# Altium schematic sheet Sheet1.SchDoc
size A1
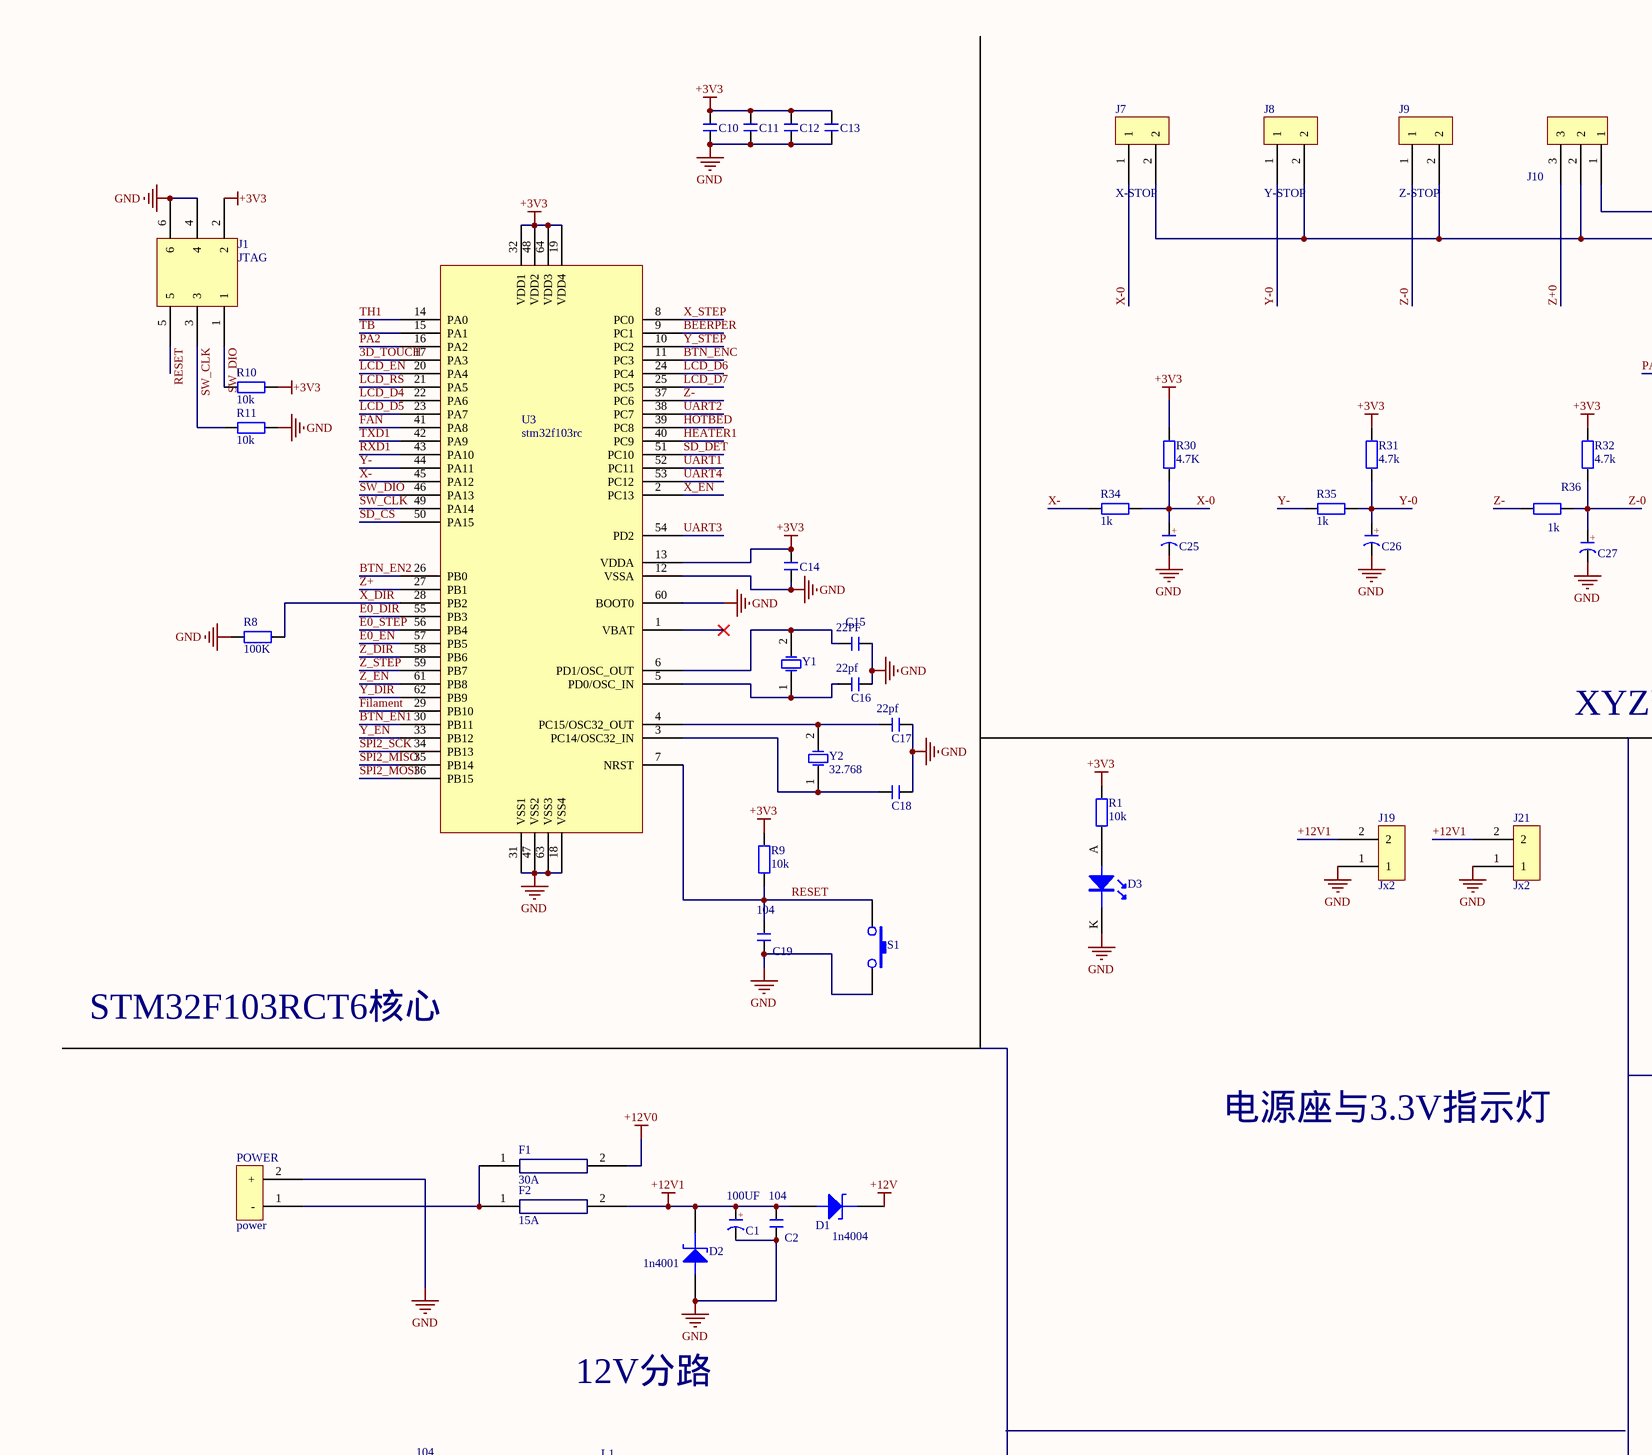
[diagram p0: Sheet1.SchDoc, top left]
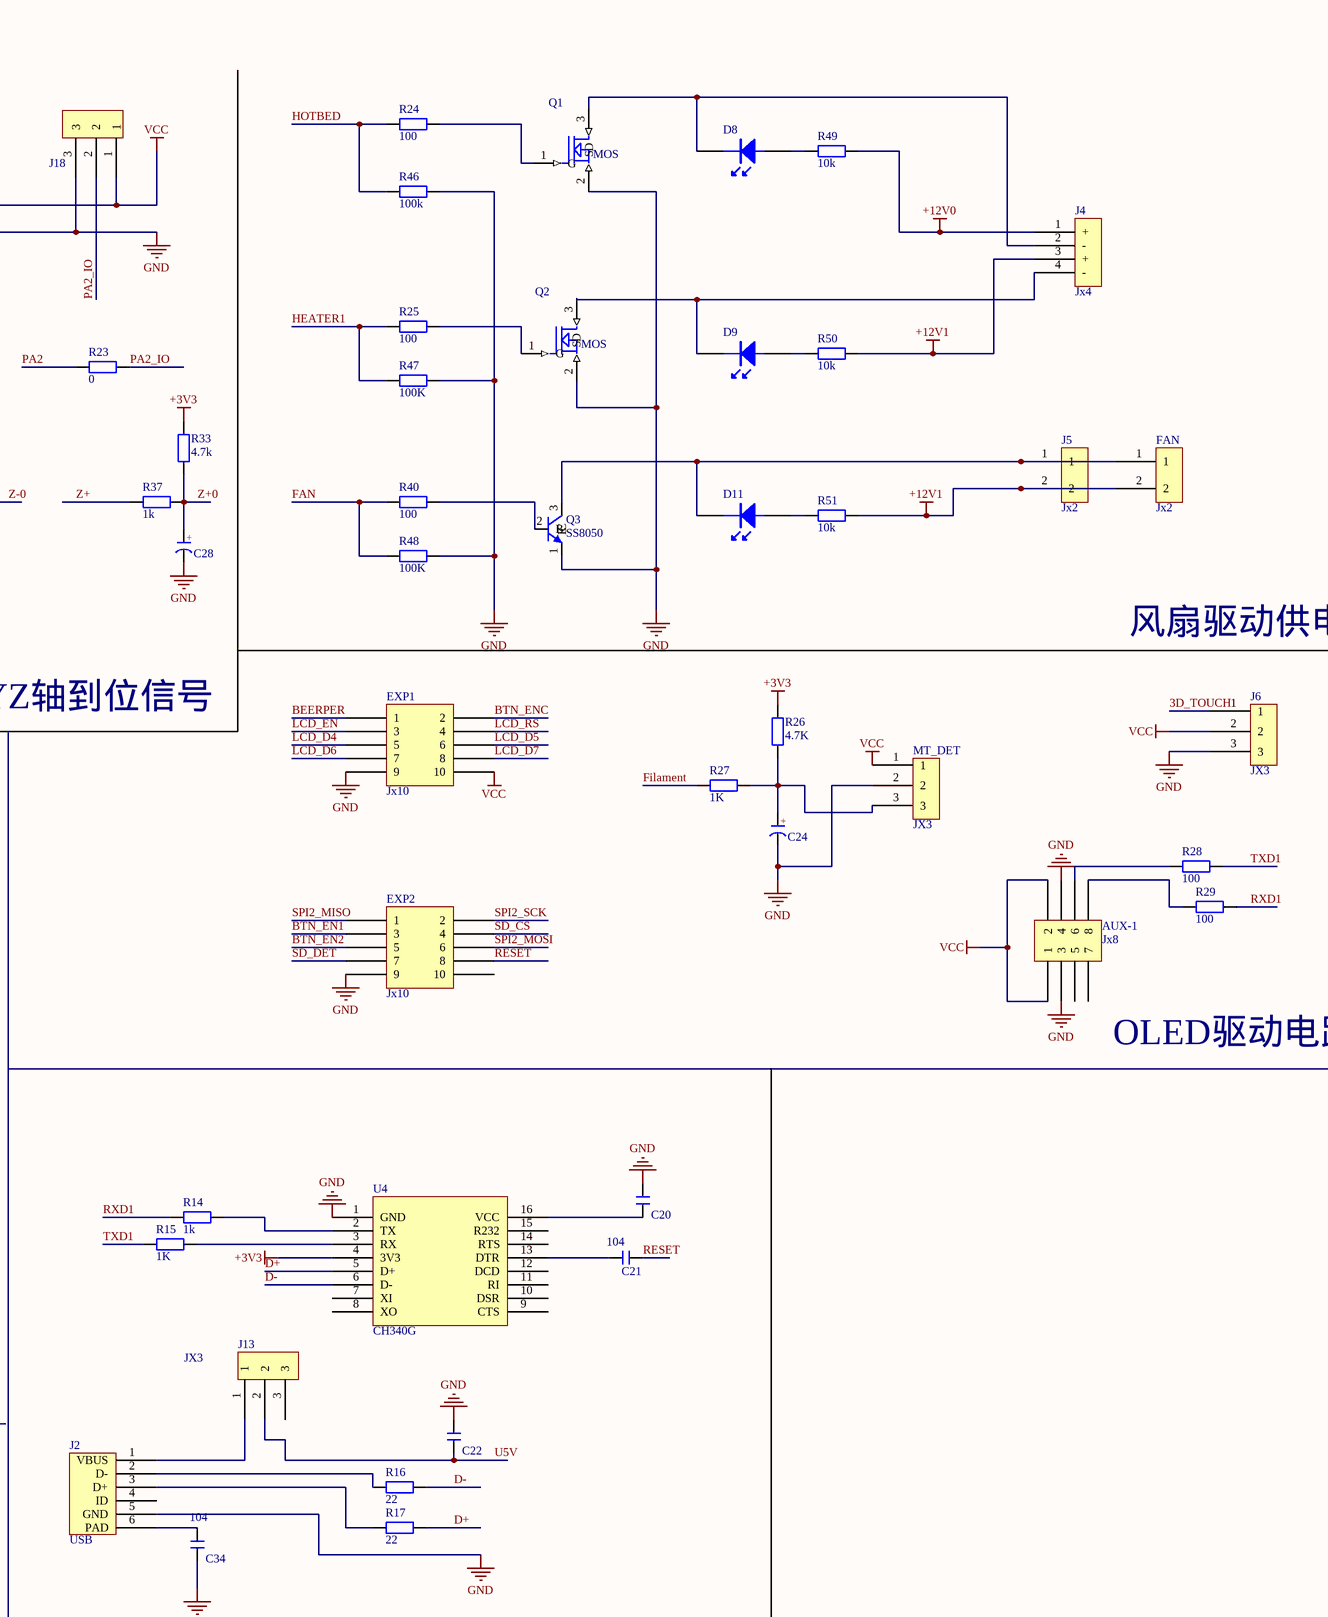
[diagram p1: Sheet1.SchDoc, top middle]
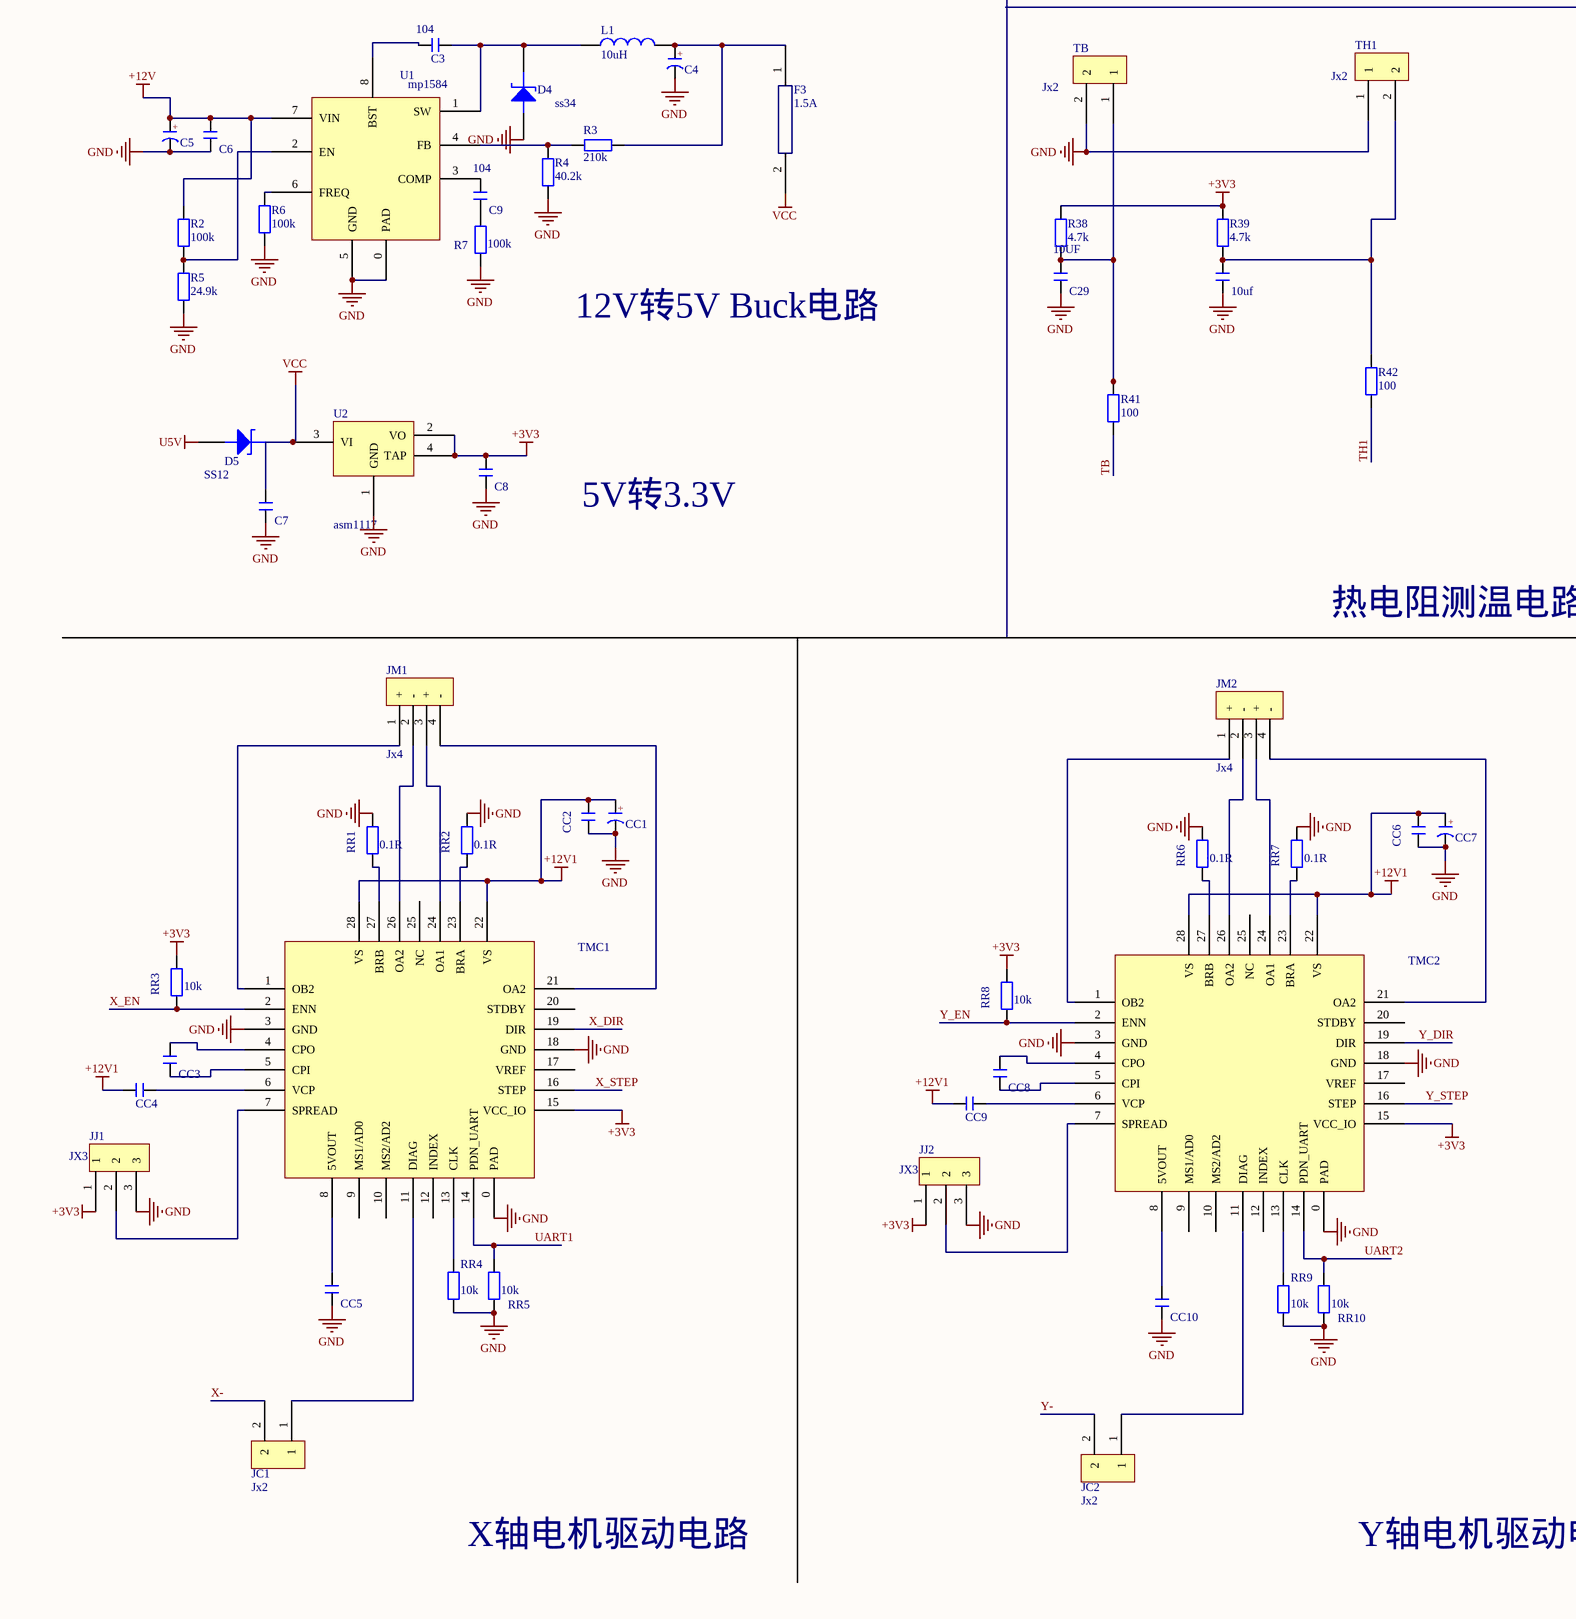
[diagram p2: Sheet1.SchDoc, bottom left]
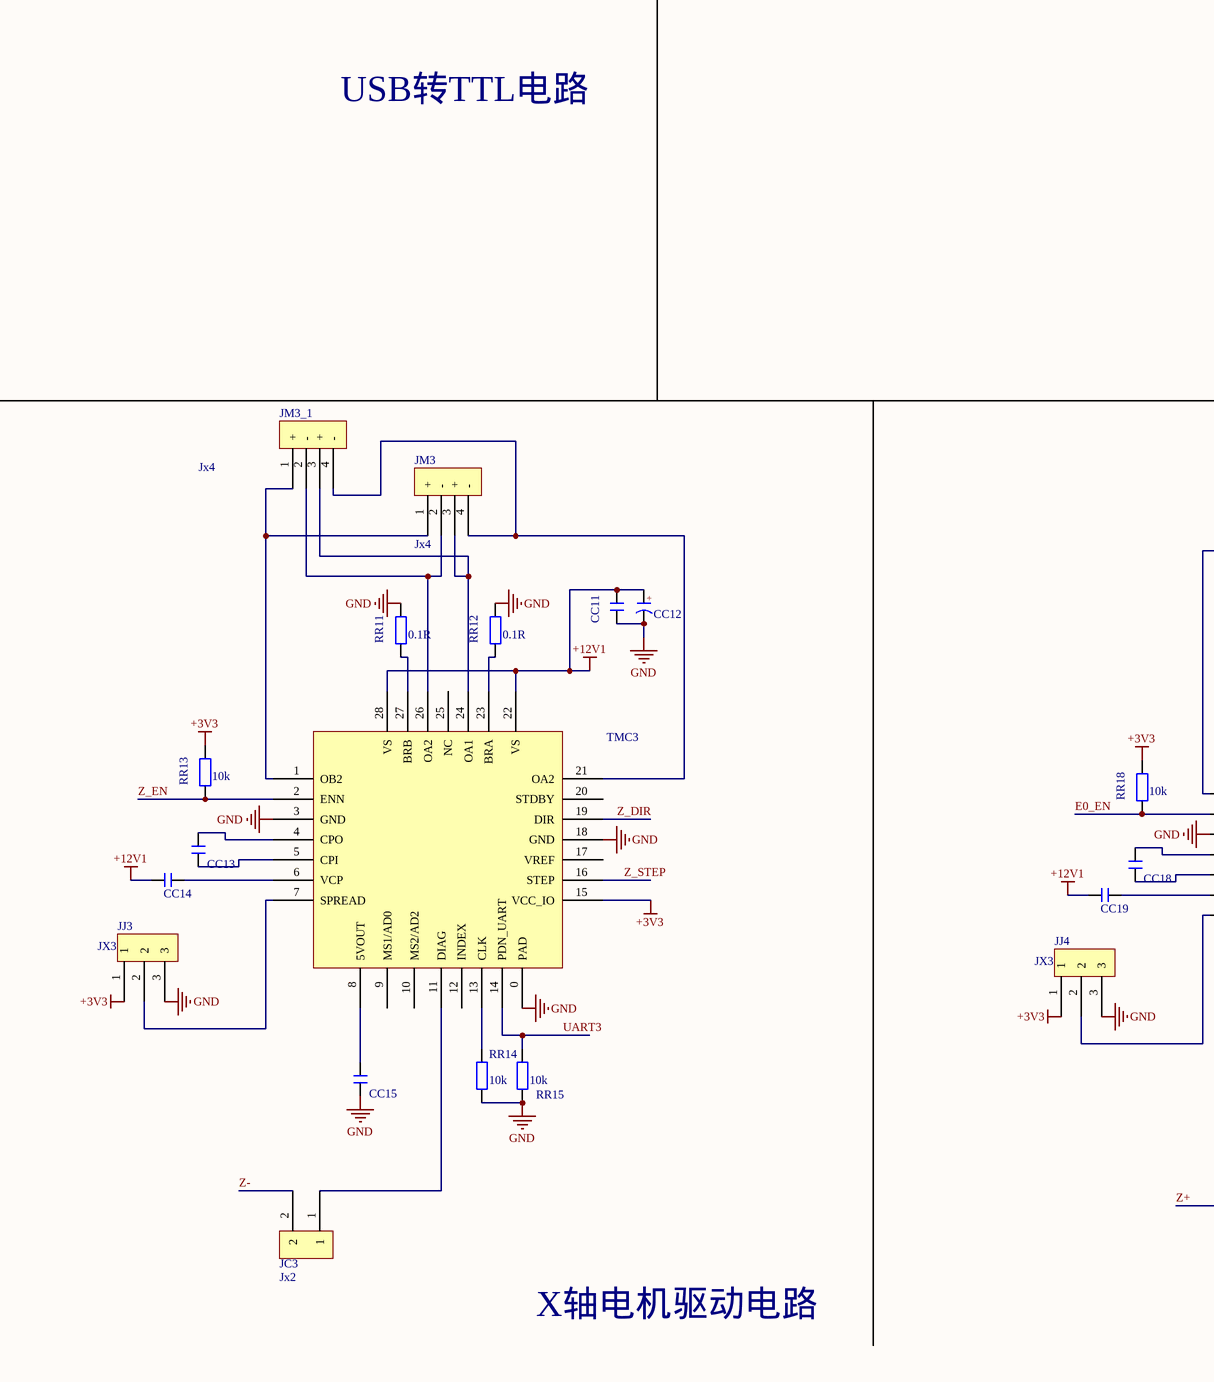
[diagram p3: Sheet1.SchDoc, bottom middle]
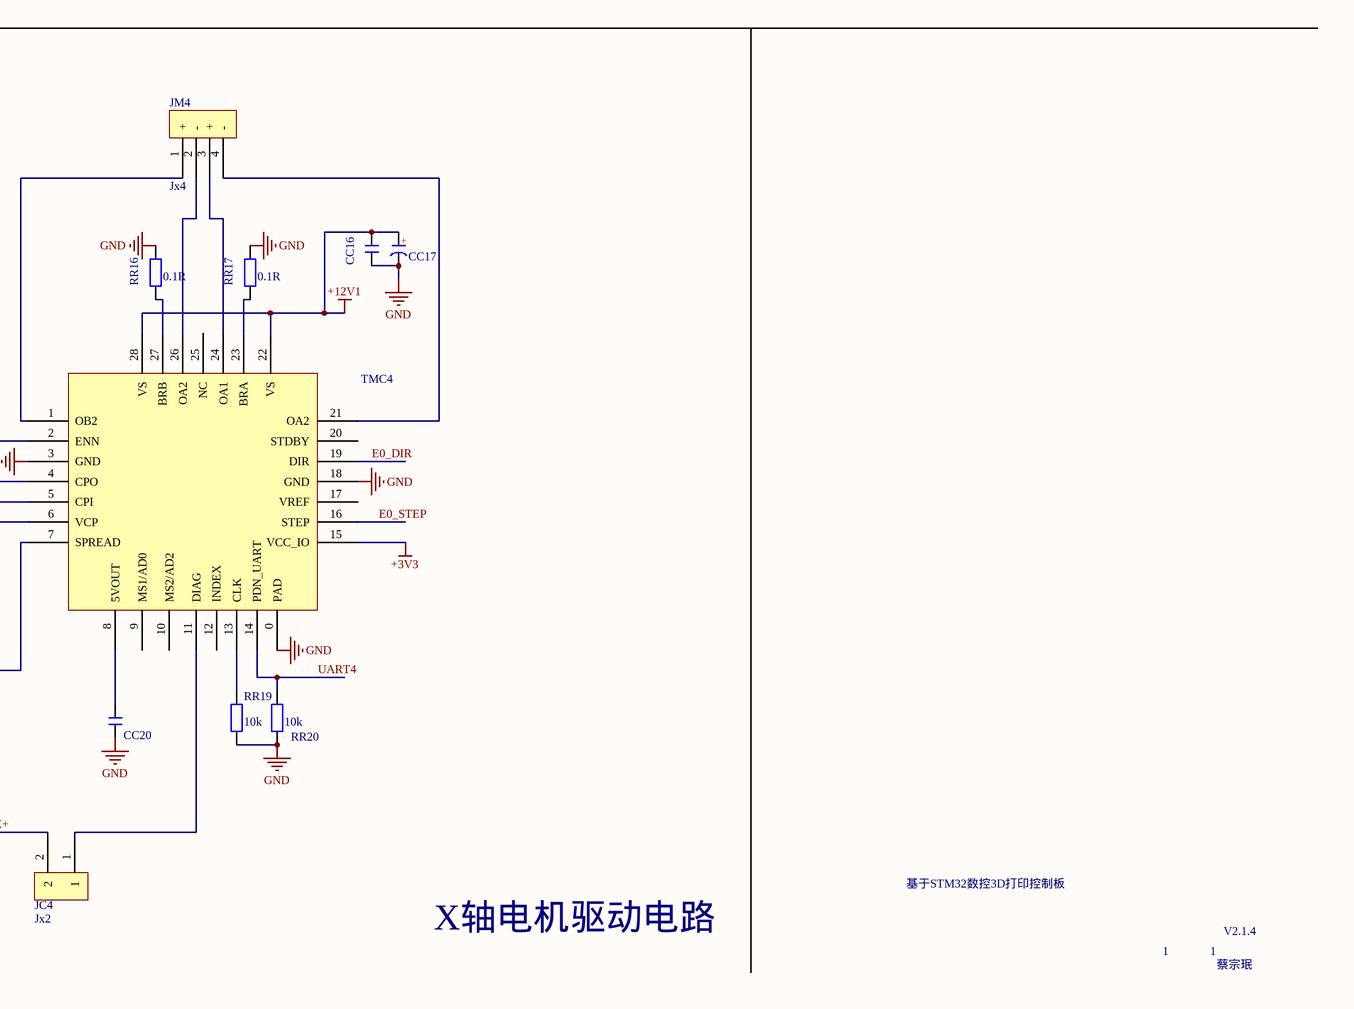
[diagram p4: Sheet1.SchDoc, bottom right]

## Parts
10uf  104  [C 0603_M]  (value not drawn)
AUX-1  Jx8  [IDC_8P]
C1  100UF  [CS 3.5*8*8 - C]
C2  104  [C 0603_M]
C3  104  [C 0603_M]
C4  220uf  [CS 3.5*8*8 - C]  (value not drawn)
C5  10uF/10V  [CS 3.5*8*8 - C]  (value not drawn)
C6  104  [C 0603_M]  (value not drawn)
C7  10uf  [C 0603_M]  (value not drawn)
C8  10uf  [C 0603_M]  (value not drawn)
C9  104  [C 0603_M]
C10  104  [C 0603_M]  (value not drawn)
C11  104  [C 0603_M]  (value not drawn)
C12  104  [C 0603_M]  (value not drawn)
C13  104  [C 0603_M]  (value not drawn)
C14  104  [C 0603_M]  (value not drawn)
C15  22PF  [C 0603_M]
C16  22pf  [C 0603_M]
C17  22pf  [C 0603_M]
C18  22pf  [C 0603_M]  (value not drawn)
C19  104  [C 0603_M]
C20  104  [C 0603_M]  (value not drawn)
C21  104  [C 0603_M]
C22  104  [C 0603_M]  (value not drawn)
C24  10uF/10V  [C 0603_M]  (value not drawn)
C25  10uF/10V  [C 0603_M]  (value not drawn)
C26  10uF/10V  [C 0603_M]  (value not drawn)
C27  10uF/10V  [C 0603_M]  (value not drawn)
C28  10uF/10V  [C 0603_M]  (value not drawn)
C29  10UF  [C 0603_M]
C34  104  [C 0603_M]
CC1  10uF/10V  [C 1206_M]  (value not drawn)
CC2  104  [C 0603_M]  (value not drawn)
CC3  104  [C 0603_M]  (value not drawn)
CC4  104  [C 0603_M]  (value not drawn)
CC5  104  [C 0603_M]  (value not drawn)
CC6  104  [C 0603_M]  (value not drawn)
CC7  10uF/10V  [C 1206_M]  (value not drawn)
CC8  104  [C 0603_M]  (value not drawn)
CC9  104  [C 0603_M]  (value not drawn)
CC10  104  [C 0603_M]  (value not drawn)
CC11  104  [C 0603_M]  (value not drawn)
CC12  10uF/10V  [C 1206_M]  (value not drawn)
CC13  104  [C 0603_M]  (value not drawn)
CC14  104  [C 0603_M]  (value not drawn)
CC15  104  [C 0603_M]  (value not drawn)
CC16  104  [C 0603_M]  (value not drawn)
CC17  10uF/10V  [C 1206_M]  (value not drawn)
CC18  104  [C 0603_M]  (value not drawn)
CC19  104  [C 0603_M]  (value not drawn)
CC20  104  [C 0603_M]  (value not drawn)
D1  1n4004  [SMA]
D2  1n4001  [SMA]
D3  发光二极管  [myLed0805]  (value not drawn)
D4  ss34  [SMA]
D5  SS12  [SMA]
D8  发光二极管  [myLed0805]  (value not drawn)
D9  发光二极管  [myLed0805]  (value not drawn)
D11  发光二极管  [myLed0805]  (value not drawn)
EXP1  Jx10  [DC3-10P]
EXP2  Jx10  [DC3-10P]
F1  30A  [FU 1206]
F2  15A  [FU 1206]
F3  1.5A  [FU 1206]
FAN  Jx2  [my_XH2.54-2]
J1  JTAG  [HDR2.54-LI-2x3P]
J2  USB  [myMicrousb]
J4  Jx4  [HX5.08-4L]
J5  Jx2  [my_XH2.54-2]
J6  JX3  [HDR2.54-LI-3P]
J7  X-STOP  [my_XH2.54-2]
J8  Y-STOP  [my_XH2.54-2]
J9  Z-STOP  [my_XH2.54-2]
J10  JX3  [XH_3p]  (value not drawn)
J13  JX3  [HDR2.54-LI-3P]
J18  JX3  [XH_3p]  (value not drawn)
J19  Jx2  [my_XH2.54-2]
J21  Jx2  [my_XH2.54-2]
JC1  Jx2  [HDR2.54-LI-2P]
JC2  Jx2  [HDR2.54-LI-2P]
JC3  Jx2  [HDR2.54-LI-2P]
JC4  Jx2  [HDR2.54-LI-2P]
JJ1  JX3  [HDR2.54-LI-3P]
JJ2  JX3  [HDR2.54-LI-3P]
JJ3  JX3  [HDR2.54-LI-3P]
JJ4  JX3  [HDR2.54-LI-3P]
JM1  Jx4  [XH2.54-4]
JM2  Jx4  [XH2.54-4]
JM3  Jx4  [XH2.54-4]
JM3_1  Jx4  [XH2.54-4]
JM4  Jx4  [XH2.54-4]
L1  10uH  [CDRH74]
MT_DET  JX3  [XH_3p]
POWER  power  [HX5.08-2L]
Q1  MOS  [TO252]
Q2  MOS  [TO252]
Q3  SS8050  [SOT23]
R1  10k  [R 0603_M]
R2  100k  [R 0603_M]
R3  210k  [R 0603_M]
R4  40.2k  [R 0603_M]
R5  24.9k  [R 0603_M]
R6  100k  [R 0603_M]
R7  100k  [R 0603_M]
R8  100K  [R 0603_M]
R9  10k  [R 0603_M]
R10  10k  [R 0603_M]
R11  10k  [R 0603_M]
R14  1k  [R 0603_M]
R15  1K  [R 0603_M]
R16  22  [R 0603_M]
R17  22  [R 0603_M]
R23  0  [R 0603_M]
R24  100  [R 0603_M]
R25  100  [R 0603_M]
R26  4.7K  [R 0603_M]
R27  1K  [R 0603_M]
R28  100  [R 0603_M]
R29  100  [R 0603_M]
R30  4.7K  [R 0603_M]
R31  4.7k  [R 0603_M]
R32  4.7k  [R 0603_M]
R33  4.7k  [R 0603_M]
R34  1k  [R 0603_M]
R35  1k  [R 0603_M]
R36  1k  [R 0603_M]
R37  1k  [R 0603_M]
R38  4.7k  [R 0603_M]
R39  4.7k  [R 0603_M]
R40  100  [R 0603_M]
R41  100  [R 0603_M]
R42  100  [R 0603_M]
R46  100k  [R 0603_M]
R47  100K  [R 0603_M]
R48  100K  [R 0603_M]
R49  10k  [R 0603_M]
R50  10k  [R 0603_M]
R51  10k  [R 0603_M]
RR1  0.1R  [R 1206_L]
RR2  0.1R  [R 1206_L]
RR3  10k  [R 0603_M]
RR4  10k  [R 0603_M]
RR5  10k  [R 0603_M]
RR6  0.1R  [R 1206_L]
RR7  0.1R  [R 1206_L]
RR8  10k  [R 0603_M]
RR9  10k  [R 0603_M]
RR10  10k  [R 0603_M]
RR11  0.1R  [R 1206_L]
RR12  0.1R  [R 1206_L]
RR13  10k  [R 0603_M]
RR14  10k  [R 0603_M]
RR15  10k  [R 0603_M]
RR16  0.1R  [R 1206_L]
RR17  0.1R  [R 1206_L]
RR18  10k  [R 0603_M]
RR19  10k  [R 0603_M]
RR20  10k  [R 0603_M]
S1  微动开关  [TSW SMD-3*6*2.5]  (value not drawn)
TB  Jx2  [my_XH2.54-2]
TH1  Jx2  [my_XH2.54-2]
TMC1  TMC2208  [my_2208]  (value not drawn)
TMC2  TMC2208  [my_2208]  (value not drawn)
TMC3  TMC2208  [my_2208]  (value not drawn)
TMC4  TMC2208  [my_2208]  (value not drawn)
U1  mp1584  [MP1584EN]
U2  asm1117  [SOT-223]
U3  stm32f103rc  [LQFP64_M]
U4  CH340G  [SOP16]
Y1  8MHz  [OSC HC-49S]  (value not drawn)
Y2  32.768  [OSC-3x8-LI]

## Nets
+3V3: C8.1 C10.2 C11.2 C12.2 C13.2 C14.2 J1.2 JJ1.1 JJ2.1 JJ3.1 JJ4.1 R1.2 R9.2 R10.1 R26.1 R30.2 R31.2 R32.2 R33.2 R38.1 R39.1 RR3.2 RR8.2 RR13.2 RR18.2 TMC1.15(VCC_IO) TMC2.15(VCC_IO) TMC3.15(VCC_IO) TMC4.15(VCC_IO) U2.2(VO) U2.4(TAP) U3.13(VDDA) U3.19(VDD4) U3.32(VDD1) U3.48(VDD2) U3.64(VDD3) U4.4(3V3)
+12V: C5.1(A) C6.1 D1.2(K) R2.2 U1.7(VIN)
+12V0: F1.2(+) J4.1(+) R49.1
+12V1: C1.1(A) C2.1 CC1.1(A) CC2.1 CC4.2 CC6.1 CC7.1(A) CC9.2 CC11.1 CC12.1(A) CC14.2 CC16.1 CC17.1(A) CC19.2 D1.1(A) D2.2(K) F2.2(+) FAN.2 J4.3(+) J5.2 J19.2 J21.2 R50.1 R51.1 TMC1.22(VS) TMC1.28(VS) TMC2.22(VS) TMC2.28(VS) TMC3.22(VS) TMC3.28(VS) TMC4.22(VS) TMC4.28(VS)
GND: 10uf.2 AUX-1.3 AUX-1.4 C1.2(K) C2.2 C4.2(K) C5.2(K) C6.2 C7.2 C8.2 C10.1 C11.1 C12.1 C13.1 C14.1 C15.1 C16.1 C17.1 C18.1 C19.2 C20.1 C22.2 C24.2(K) C25.2(K) C26.2(K) C27.2(K) C28.2(K) C29.2 C34.1 CC1.2(K) CC2.2 CC5.2 CC6.2 CC7.2(K) CC10.2 CC11.2 CC12.2(K) CC15.2 CC16.2 CC17.2(K) CC20.2 D2.1(A) D3.K D4.1(A) EXP1.9 EXP2.9 J1.4 J1.6 J2.5(GND) J6.3 J7.2 J8.2 J9.2 J10.2 J18.3 J19.1 J21.1 JJ1.3 JJ2.3 JJ3.3 JJ4.3 MT_DET.2 POWER.2(+) Q1.2(S) Q2.2(S) Q3.1(E) R4.1 R5.1 R6.1 R7.1 R8.2 R11.1 R46.1 R47.1 R48.1 RR1.2 RR2.2 RR4.1 RR5.1 RR6.2 RR7.2 RR9.1 RR10.1 RR11.2 RR12.2 RR14.1 RR15.1 RR16.2 RR17.2 RR19.1 RR20.1 S1.2 TB.2 TH1.1 TMC1.0(PAD) TMC1.3(GND) TMC1.18(GND) TMC2.0(PAD) TMC2.3(GND) TMC2.18(GND) TMC3.0(PAD) TMC3.3(GND) TMC3.18(GND) TMC4.0(PAD) TMC4.3(GND) TMC4.18(GND) U1.0(PAD) U1.5(GND) U2.1(GND) U3.12(VSSA) U3.18(VSS4) U3.31(VSS1) U3.47(VSS2) U3.60(BOOT0) U3.63(VSS3) U4.1(GND)
U5V: C22.1 D5.1(A) J13.2
VCC: AUX-1.1 AUX-1.2 C7.1 D5.2(K) EXP1.10 F3.2(+) J6.2 J10.1 J18.1 MT_DET.1 U2.3(VI)
3D_TOUCH: J6.1 U3.17(PA3)
BEERPER: EXP1.1 U3.9(PC1)
BTN_EN1: EXP2.3 U3.30(PB11)
BTN_EN2: EXP2.5 U3.26(PB0)
BTN_ENC: EXP1.2 U3.11(PC3)
D+: R17.1 U4.5(D+)
D-: R16.1 U4.6(D-)
E0_DIR: TMC4.19(DIR) U3.55(PB3)
E0_EN: RR18.1 TMC4.2(ENN) U3.57(PB5)
E0_STEP: TMC4.16(STEP) U3.56(PB4)
FAN: R40.2 R48.2 U3.41(PA8)
Filament: R27.2 U3.29(PB10)
HEATER1: R25.2 R47.2 U3.40(PC9)
HOTBED: R24.2 R46.2 U3.39(PC8)
LCD_D4: EXP1.5 U3.22(PA6)
LCD_D5: EXP1.6 U3.23(PA7)
LCD_D6: EXP1.7 U3.24(PC4)
LCD_D7: EXP1.8 U3.25(PC5)
LCD_EN: EXP1.3 U3.20(PA4)
LCD_RS: EXP1.4 U3.21(PA5)
PA2: R23.2 U3.16(PA2)
PA2_IO: J18.2 R23.1
RESET: C19.1 C21.2 EXP2.8 J1.5 R9.1 S1.1 U3.7(NRST)
RXD1: R14.2 R29.1 U3.43(PA10)
SD_CS: EXP2.4 U3.50(PA15)
SD_DET: EXP2.7 U3.51(PC10)
SPI2_MISO: EXP2.1 U3.35(PB14)
SPI2_MOSI: EXP2.6 U3.36(PB15)
SPI2_SCK: EXP2.2 U3.34(PB13)
SW_CLK: J1.3 R11.2 U3.49(PA14)
SW_DIO: J1.1 R10.2 U3.46(PA13)
TB: R41.2 U3.15(PA1)
TH1: R42.2 U3.14(PA0)
TXD1: R15.2 R28.1 U3.42(PA9)
UART1: RR5.2 TMC1.14(PDN_UART) U3.52(PC11)
UART2: RR10.2 TMC2.14(PDN_UART) U3.38(PC7)
UART3: RR15.2 TMC3.14(PDN_UART) U3.54(PD2)
UART4: RR20.2 TMC4.14(PDN_UART) U3.53(PC12)
X-: JC1.2 R34.2 U3.45(PA12)
X-0: C25.1(A) J7.1 R30.1 R34.1
X_DIR: R8.1 TMC1.19(DIR) U3.28(PB2)
X_EN: RR3.1 TMC1.2(ENN) U3.2(PC13)
X_STEP: TMC1.16(STEP) U3.8(PC0)
Y-: JC2.2 R35.2 U3.44(PA11)
Y-0: C26.1(A) J8.1 R31.1 R35.1
Y_DIR: TMC2.19(DIR) U3.62(PB9)
Y_EN: RR8.1 TMC2.2(ENN) U3.33(PB12)
Y_STEP: TMC2.16(STEP) U3.10(PC2)
Z+: JC4.2 R37.2 U3.27(PB1)
Z+0: C28.1(A) J10.3 R33.1 R37.1
Z-: JC3.2 R36.2 U3.37(PC6)
Z-0: C27.1(A) J9.1 R32.1 R36.1
Z_DIR: TMC3.19(DIR) U3.58(PB6)
Z_EN: RR13.1 TMC3.2(ENN) U3.61(PB8)
Z_STEP: TMC3.16(STEP) U3.59(PB7)
Net10uf_1: 10uf.1 R39.2 R42.1 TH1.2
NetAUX-1_6: AUX-1.6 R28.2
NetAUX-1_8: AUX-1.8 R29.2
NetC3_1: C3.1 U1.8(BST)
NetC3_2: C3.2 D4.2(K) L1.1 U1.1(SW)
NetC4_1: C4.1(A) F3.1(+) L1.2 R3.1
NetC9_1: C9.1 U1.3(COMP)
NetC9_2: C9.2 R7.2
NetC15_2: C15.2 U3.6(PD1/OSC_OUT) Y1.2(OSC2)
NetC16_2: C16.2 U3.5(PD0/OSC_IN) Y1.1(OSC1)
NetC17_2: C17.2 U3.4(PC15/OSC32_OUT) Y2.2(OSC2)
NetC18_2: C18.2 U3.3(PC14/OSC32_IN) Y2.1(OSC1)
NetC20_2: C20.2 U4.16(VCC)
NetC21_1: C21.1 U4.13(DTR)
NetC24_1: C24.1(A) MT_DET.3 R26.2 R27.1
NetC29_1: C29.1 R38.2 R41.1 TB.1
NetC34_2: C34.2 J2.6(PAD)
NetCC3_1: CC3.1 TMC1.5(CPI)
NetCC3_2: CC3.2 TMC1.4(CPO)
NetCC4_1: CC4.1 TMC1.6(VCP)
NetCC5_1: CC5.1 TMC1.8(5VOUT)
NetCC8_1: CC8.1 TMC2.5(CPI)
NetCC8_2: CC8.2 TMC2.4(CPO)
NetCC9_1: CC9.1 TMC2.6(VCP)
NetCC10_1: CC10.1 TMC2.8(5VOUT)
NetCC13_1: CC13.1 TMC3.5(CPI)
NetCC13_2: CC13.2 TMC3.4(CPO)
NetCC14_1: CC14.1 TMC3.6(VCP)
NetCC15_1: CC15.1 TMC3.8(5VOUT)
NetCC18_1: CC18.1 TMC4.5(CPI)
NetCC18_2: CC18.2 TMC4.4(CPO)
NetCC19_1: CC19.1 TMC4.6(VCP)
NetCC20_1: CC20.1 TMC4.8(5VOUT)
NetD3_A: D3.A R1.1
NetD8_A: D8.A R49.2
NetD8_K: D8.K J4.2(-) Q1.3(D)
NetD9_A: D9.A R50.2
NetD9_K: D9.K J4.4(-) Q2.3(D)
NetD11_A: D11.A R51.2
NetD11_K: D11.K FAN.1 J5.1 Q3.3(C)
NetF1_1: F1.1(+) F2.1(+) POWER.1(-)
NetJ2_1: J2.1(VBUS) J13.1
NetJ2_2: J2.2(D-) R16.2
NetJ2_3: J2.3(D+) R17.2
NetJC1_1: JC1.1 TMC1.11(DIAG)
NetJC2_1: JC2.1 TMC2.11(DIAG)
NetJC3_1: JC3.1 TMC3.11(DIAG)
NetJC4_1: JC4.1 TMC4.11(DIAG)
NetJJ1_2: JJ1.2 TMC1.7(SPREAD)
NetJJ2_2: JJ2.2 TMC2.7(SPREAD)
NetJJ3_2: JJ3.2 TMC3.7(SPREAD)
NetJJ4_2: JJ4.2 TMC4.7(SPREAD)
NetJM1_1: JM1.1(+) TMC1.1(OB2)
NetJM1_2: JM1.2(-) TMC1.26(OA2)
NetJM1_3: JM1.3(+) TMC1.24(OA1)
NetJM1_4: JM1.4(-) TMC1.21(OA2)
NetJM2_1: JM2.1(+) TMC2.1(OB2)
NetJM2_2: JM2.2(-) TMC2.26(OA2)
NetJM2_3: JM2.3(+) TMC2.24(OA1)
NetJM2_4: JM2.4(-) TMC2.21(OA2)
NetJM3_1: JM3.1(+) JM3_1.1(+) TMC3.1(OB2)
NetJM3_2: JM3.2(-) JM3_1.2(-) TMC3.26(OA2)
NetJM3_3: JM3.3(+) JM3_1.3(+) TMC3.24(OA1)
NetJM3_4: JM3.4(-) JM3_1.4(-) TMC3.21(OA2)
NetJM4_1: JM4.1(+) TMC4.1(OB2)
NetJM4_2: JM4.2(-) TMC4.26(OA2)
NetJM4_3: JM4.3(+) TMC4.24(OA1)
NetJM4_4: JM4.4(-) TMC4.21(OA2)
NetQ1_1: Q1.1(G) R24.1
NetQ2_1: Q2.1(G) R25.1
NetQ3_2: Q3.2(B) R40.1
NetR2_1: R2.1 R5.2 U1.2(EN)
NetR3_2: R3.2 R4.2 U1.4(FB)
NetR6_2: R6.2 U1.6(FREQ)
NetR14_1: R14.1 U4.2(TX)
NetR15_1: R15.1 U4.3(RX)
NetRR1_1: RR1.1 TMC1.27(BRB)
NetRR2_1: RR2.1 TMC1.23(BRA)
NetRR4_2: RR4.2 TMC1.13(CLK)
NetRR6_1: RR6.1 TMC2.27(BRB)
NetRR7_1: RR7.1 TMC2.23(BRA)
NetRR9_2: RR9.2 TMC2.13(CLK)
NetRR11_1: RR11.1 TMC3.27(BRB)
NetRR12_1: RR12.1 TMC3.23(BRA)
NetRR14_2: RR14.2 TMC3.13(CLK)
NetRR16_1: RR16.1 TMC4.27(BRB)
NetRR17_1: RR17.1 TMC4.23(BRA)
NetRR19_2: RR19.2 TMC4.13(CLK)

Not connected (* = marked no-connect by the designer): AUX-1 5 7; EXP2 10; J2 4(ID); J13 3; TMC1 9(MS1/AD0) 10(MS2/AD2) 12(INDEX) 17(VREF) 20(STDBY) 25(NC); TMC2 9(MS1/AD0) 10(MS2/AD2) 12(INDEX) 17(VREF) 20(STDBY) 25(NC); TMC3 9(MS1/AD0) 10(MS2/AD2) 12(INDEX) 17(VREF) 20(STDBY) 25(NC); TMC4 9(MS1/AD0) 10(MS2/AD2) 12(INDEX) 17(VREF) 20(STDBY) 25(NC); U3 1(VBAT)*; U4 7(XI) 8(XO) 9(CTS) 10(DSR) 11(RI) 12(DCD) 14(RTS) 15(R232)

## Notes on the sheet
- 风扇驱动供电
- XYZ轴到位信号
- STM32F103RCT6核心
- OLED驱动电路
- 电源座与3.3V指示灯
- 12V分路
- 12V转5V Buck电路
- USB转TTL电路
- 5V转3.3V
- 热电阻测温电路
- 基于STM32数控3D打印控制板
- X轴电机驱动电路
- Y轴电机驱动电路
- 1
- 蔡宗珉
- V2.1.4
- (in symbol C-CM) +

## Library data of the parts
10uf C2 C3 C6-C22 C29 C34 CC2-CC6 CC8-CC11 CC13-CC16 CC18-CC20 = C: 无极性贴片电容; 版权归属: 源创客; BOM名称: 无极性贴片电容; 学习资源: www.ooocke.com
C1 C4 C5 C24-C28 CC1 CC7 CC12 CC17 = C-CM: 贴片电解电容; 版权归属: 源创客; BOM名称: 贴片电解电容; 学习资源: www.ooocke.com
D1 D2 D4 D5 = ZENER2: Zener Diode
F1-F3 = fruse
J1 = J_2X3
J4 = Jx4: pin to pad: 1>4 2>3 3>2 4>1
J7-J9 TB = Jx2: pin to pad: 1>2 2>1
L1 = L: 小功率贴片电感; 版权归属: 源创客; BOM名称: 小功率贴片电感; 学习资源: www.ooocke.com
POWER = power: pin to pad: 1>2 2>1
Q1 Q2 = MOS: pin to pad: 2>3 3>2
Q3 = 8050-DIP: 高频放大-NPN型; 版权归属: 源创客; 属性: 40V 1.5A 1W 100MHZ; BOM名称: 高频放大-NPN型; 学习资源: www.ooocke.com
R1-R11 R14-R17 R23-R42 R46-R51 RR1-RR20 = R-I: 电流检测电阻; 版权归属: 源创客; BOM名称: 电流检测电阻; 学习资源: www.ooocke.com
U3 = STM32_F103RC
Y1 Y2 = XTAL: Crystal Oscillator; Published: 8-Jun-2000; LatestRevisionDate: 17-Jul-2002; LatestRevisionNote: Re-released for DXP Platform.; Publisher: Altium Limited